# Altium schematic sheet 9-Other_Inputs.SchDoc
size A4
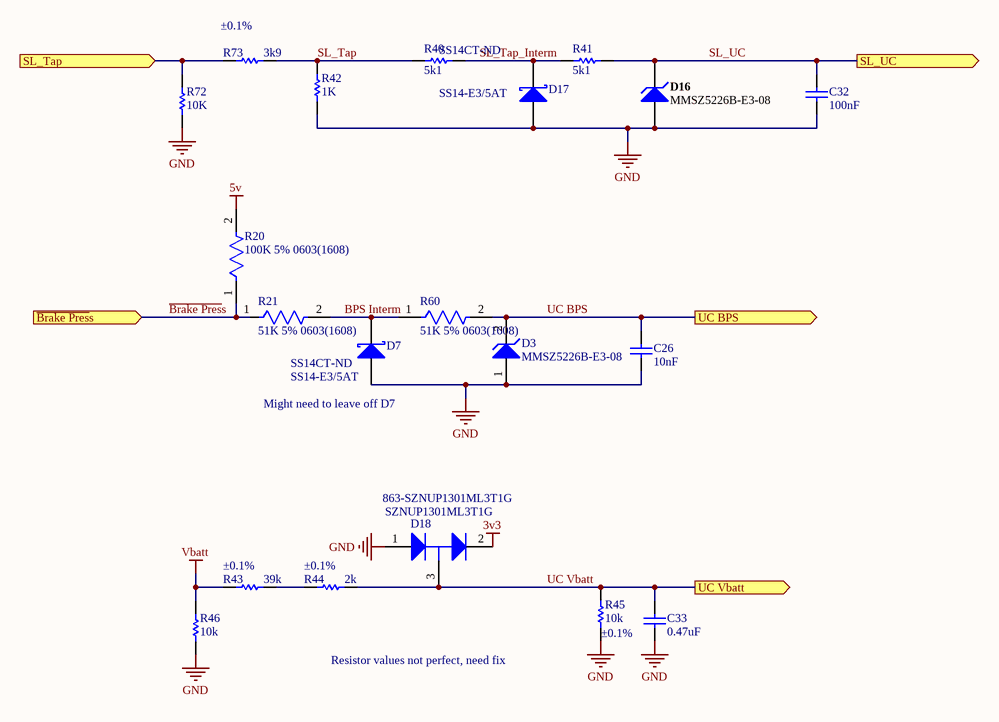
[diagram p0: 9-Other_Inputs.SchDoc]

## Parts
C26  value 10nF  [1608[0603]]  (hidden comment: Cap)
C32  value 100nF  [1608[0603]]  (hidden comment: Cap)
C33  value 0.47uF  [1608[0603]]  (hidden comment: Cap)
D3  MMSZ5226B-E3-08  [VISH-SOD-123-2_V]
D7  SS14-E3/5AT  Supplier Part Number 1: SS14CT-ND  [VISH-DO-214AC-2_V]
D16  MMSZ5226B-E3-08  [VISH-SOD-123-2_V]
D17  SS14-E3/5AT  Supplier Part Number 1: SS14CT-ND  [VISH-DO-214AC-2_V]
D18  SZNUP1301ML3T1G  Supplier Part Number 1: 863-SZNUP1301ML3T1G  [ONSC-SOT-23-3-318-08_V]
R20  100K 5% 0603(1608)  [RESC0603(1608)_N]
R21  51K 5% 0603(1608)  [RESC0603(1608)_N]
R40  value 5k1  [1608[0603]]  (hidden comment: Res1)
R41  value 5k1  [1608[0603]]  (hidden comment: Res1)
R42  value 1K  [1608[0603]]  (hidden comment: Res1)
R43  value 39k  Tolerance: ±0.1%  [1608[0603]]  (hidden comment: Res1)
R44  value 2k  Tolerance: ±0.1%  [1608[0603]]  (hidden comment: Res1)
R45  value 10k  Tolerance: ±0.1%  [1608[0603]]  (hidden comment: Res1)
R46  value 10k  [1608[0603]]  (hidden comment: Res1)
R60  51K 5% 0603(1608)  [RESC0603(1608)_N]
R72  10K  [RESC0603(1608)_N]
R73  value 3k9  Tolerance: ±0.1%  [1608[0603]]  (hidden comment: Res1)

## Ports
SL_Tap (in), SL_UC (out), UC BPS (out), UC Vbatt (out), ~{Brake Pres}s (in)

## Nets
3v3: D18.2(K)
5v: R20.2
GND: C26.1 C32.1 C33.1 D3.1(K) D7.1(A) D16.1(A) D17.1(A) D18.1(A) R42.1 R45.1 R46.1 R72.1
Vbatt: R43.1 R46.2
~{Brake Pres}s: R20.1 R21.1 ; port ~{Brake Pres}s
BPS Interm: D7.2(K) R21.2 R60.1
SL_Tap: R40.2 R42.2 R73.2
SL_Tap: R72.2 R73.1 ; port SL_Tap  [a separate net that carries the same name]
SL_Tap_Interm: D17.2(K) R40.1 R41.2
SL_UC: C32.2 D16.2(K) R41.1 ; port SL_UC
UC BPS: C26.2 D3.2(A) R60.2 ; port UC BPS
UC Vbatt: C33.2 D18.3(K/A) R44.2 R45.2 ; port UC Vbatt
NetR43_2: R43.2 R44.1

## Notes on the sheet
- (near D7) Might need to leave off D7
- Resistor values not perfect, need fix

## Library data of the parts
C26 = Cap: Capacitor; Manufacturer: Yageo; Manufacturer Part Number: CC0603KRX7R9BB104; Capacitance: 0.10µF; Tolerance: ±10%; Voltage - Rated: 50V; Temperature Coefficient: X7R; Supplier 1: Digi-Key; Supplier Part Number 1: 311-1344-1-ND; RoHS: RoHS Compliant; Category: Capacitors; Stock 1: 4016262; Pricing 1: 1=0.15, 10=0.043, 25=0.0312, 50=0.0232, 100=0.0189, 250=0.0158, 500=0.01346, 1000=0.01059 (CAD); Packaging: Cut Tape (CT); Part Status: Active; Operating Temperature: -55°C ~ 125°C; Features: -; Ratings: -; Applications: General Purpose; Failure Rate: -; Mounting Type: Surface Mount, MLCC; Package / Case: 0603 (1608 Metric); Size / Dimension: 0.063" L x 0.031" W (1.60mm x 0.80mm); Height - Seated (Max): -; Thickness (Max): 0.035" (0.90mm); Lead Spacing: -; Lead Style: -; ComponentLink1URL: http://www.yageo.com/documents/recent/UPY-GPHC_X7R_6.3V-to-50V_16.pdf; ComponentLink1Description: http://www.yageo.com/documents/recent/UPY-GPHC_X7R_6.3V-to-50V_16.pdf
C32 = Cap: Capacitor; Manufacturer: Yageo; Manufacturer Part Number: CC0603KRX7R9BB102; Capacitance: 1000pF; Tolerance: ±10%; Voltage - Rated: 50V; Temperature Coefficient: X7R; Supplier 1: Digi-Key; Supplier Part Number 1: 311-1080-1-ND; RoHS: RoHS Compliant; Category: Capacitors; Stock 1: 783486; Pricing 1: 1=0.15, 10=0.029, 25=0.0212, 50=0.0158, 100=0.0129, 250=0.01084, 500=0.00928, 1000=0.00729 (CAD); Packaging: Cut Tape (CT); Part Status: Active; Operating Temperature: -55°C ~ 125°C; Features: -; Ratings: -; Applications: General Purpose; Failure Rate: -; Mounting Type: Surface Mount, MLCC; Package / Case: 0603 (1608 Metric); Size / Dimension: 0.063" L x 0.031" W (1.60mm x 0.80mm); Height - Seated (Max): -; Thickness (Max): 0.035" (0.90mm); Lead Spacing: -; Lead Style: -; ComponentLink1URL: http://www.yageo.com/documents/recent/UPY-GPHC_X7R_6.3V-to-50V_16.pdf; ComponentLink1Description: http://www.yageo.com/documents/recent/UPY-GPHC_X7R_6.3V-to-50V_16.pdf
C33 = Cap: Capacitor; Manufacturer: Yageo; Manufacturer Part Number: CC0603KRX7R8BB474; Capacitance: 0.47µF; Tolerance: ±10%; Voltage - Rated: 25V; Temperature Coefficient: X7R; Supplier 1: Digi-Key; Supplier Part Number 1: 311-1805-1-ND; RoHS: RoHS Compliant; Category: Capacitors; Stock 1: 11076; Pricing 1: 1=0.22, 10=0.158, 25=0.1156, 50=0.0898, 100=0.0745, 250=0.06168, 500=0.05226, 1000=0.04324 (CAD); Packaging: Cut Tape (CT); Part Status: Active; Operating Temperature: -55°C ~ 125°C; Features: -; Ratings: -; Applications: General Purpose; Failure Rate: -; Mounting Type: Surface Mount, MLCC; Package / Case: 0603 (1608 Metric); Size / Dimension: 0.063" L x 0.031" W (1.60mm x 0.80mm); Height - Seated (Max): -; Thickness (Max): 0.035" (0.90mm); Lead Spacing: -; Lead Style: -; ComponentLink1URL: http://www.yageo.com/documents/recent/UPY-GPHC_X7R_6.3V-to-50V_16.pdf; ComponentLink1Description: http://www.yageo.com/documents/recent/UPY-GPHC_X7R_6.3V-to-50V_16.pdf
D3 = CMP-1060-00513-1: Zener Voltage Regulator, 500 mW, 2-Pin SOD-123, Pb-Free, Tape and Reel; PartNumber: MMSZ3V6T1G; Manufacturer: On Semiconductor; P Max (W): 0.5; Packing: Tape and Reel; ComponentLink2URL: http://www.onsemi.com/pub_link/Collateral/MMSZ2V4T1-D.PDF; ComponentLink1Description: Manufacturer URL; PackageVersion: Rev. G, 10/2009; PackageDescription: 2-Pin SOD, Body 1.6 x 2.69 mm; ComponentLink2Description: Datasheet; DatasheetVersion: Rev. 11; ComponentLink3Description: Package Specification; ComponentLink3URL: http://www.onsemi.com/pub_link/Collateral/425-04.PDF; Mounting Technology: Surface Mount; PackageReference: SOD-123-2-425-04; ComponentLink1URL: http://www.onsemi.com/; RoHS: Pb-Free
D7 D17 = CMP-0549-00004-1: Schottky Barrier Rectifier, 40 V Maximum DC Blocking Voltage, -65 to 125 degC, 2-Pin SMA Case, RoHS; Manufacturer: Vishay Semiconductor; IFSM: 40 A; IF(AV): 1 A Max.; VRRM: 40 V Max.; VRMS: 28 V Max.; PackageReference: DO-214AC-2; RoHS: TRUE; DatasheetVersion: 12/17/2012; ComponentLink1Description: Manufacturer URL; ComponentLink2URL: http://www.vishay.com/docs/88746/ss12.pdf; PartNumber: SS14-E3/5AT; PackageVersion: Dec-12; Operating Temperature: -65 to 125 degC; ComponentLink3URL: http://www.vishay.com/docs/88746/ss12.pdf; PackageDescription: 2-Pin SMD, Body 4.245 x 2.665 mm, Height 2.29 mm; ComponentLink1URL: http://www.vishay.com/; ComponentLink3Description: Package Specification; ComponentLink2Description: Datasheet; Mounting Technology: Surface Mount; VDC: 40 V Max.; Supplier 1: Digi-Key
D16 = CMP-0931-00026-1: Small Signal Zener Diode, 3.3 V +/- 5%, -55 to 155 degC, 2-Pin SOD-123, RoHS, Tape and Reel; Manufacturer: Vishay Semiconductor; Manufacturer Part Number: MMSZ5226B-7-F; Tolerance: +/- 5%; Test Current (IZT1) (mA): 20; Power Dissipation (mW): 500; Int. Construction: Single; Zener Impedance (IZT1) (Max.) (Ohm): 28; Zener Voltage (NOM.) (V): 3.3; Voltage - Zener (Nom) (Vz): 3.3V; Power - Max: 500mW; Impedance (Max) (Zzt): 28 Ohm; Current - Reverse Leakage @ Vr: 25µA @ 1V; Voltage - Forward (Vf) (Max) @ If: 900mV @ 10mA; DatasheetVersion: Rev. 1.9; ComponentLink2Description: Datasheet; PackageReference: SOD-123-2; ComponentLink1URL: http://www.vishay.com/; ComponentLink1Description: Manufacturer URL; Mounting Technology: Surface Mount; ComponentLink3Description: Package Specification; ComponentLink3URL: http://www.vishay.com/docs/85774/mmsz5225.pdf; PartNumber: MMSZ5226B-E3-08; PackageDescription: 2-Pin SMD, Body 2.7 x 1.55 mm, Height 1.35 mm; Operating Temperature: -55 to 150 degC; Packing: Tape and Reel; PackageVersion: Rev. 1.9; ComponentLink2URL: http://www.vishay.com/docs/85774/mmsz5225.pdf; RoHS: TRUE; Supplier 1: Digi-Key; Supplier Part Number 1: MMSZ5226B-FDICT-ND; Category: Discrete Semiconductor Products; Stock 1: 45935; Pricing 1: 1=0.29, 10=0.263, 100=0.1426, 500=0.08778, 1000=0.05985 (CAD); Packaging: Cut Tape (CT); Part Status: Active; Mounting Type: Surface Mount; Package / Case: SOD-123; Supplier Device Package: SOD-123; ComponentLink4URL: http://www.diodes.com/_files/datasheets/ds18010.pdf; ComponentLink4Description: http://www.diodes.com/_files/datasheets/ds18010.pdf
D18 = CMP-1063-00171-1: Low Capacitance Diode Array for ESD Protection in a Single Data Line, 3-Pin SOT-23, Pb-Free, Tape and Reel; Manufacturer: On Semiconductor; C Max (pF): 0.9; Direction: Bidirectional; V(BR) Min (V): 70; Number of Lines: 1; Mounting Technology: Surface Mount; PackageReference: SOT-23-3-318-08; DatasheetVersion: Rev. 6; PackageVersion: Rev. AP, 11/2009; RoHS: Pb-Free; ComponentLink1Description: Manufacturer URL; ComponentLink1URL: http://www.onsemi.com/; PackageDescription: 3-Pin Small Outline Transistor, Body 2.92 x 1.3 mm, Pitch 0.95 mm; PartNumber: SZNUP1301ML3T1G; Packing: Tape and Reel; ComponentLink3URL: http://www.onsemi.cn/pub_link/Collateral/318-08.PDF; ComponentLink3Description: Package Specification; VRWM Max (V): 70; ComponentLink2Description: Datasheet; ComponentLink2URL: http://www.onsemi.cn/pub_link/Collateral/NUP1301ML3T1-D.PDF; Supplier 1: Mouser
R20 R21 R60 = CMP-26527-002098-1: 10kΩ ±5% 0.1W 0603 Thick Film Chip Resistor AEC-Q200 compliant; Power Rating: 100mW; Temperature Coefficient: 100ppm/°C; Resistance: 10kR; Radiation Hardening: No; Military Standard: Not; Mount: Surface Mount; Resistor Type: Thick Film; Size Code: 0603; Case/Package: 0603; Min Operating Temperature: -55°C; Construction: Rectangular; Series: RMCF; Width: 0.031inch; Length: 1.55mm; Case Code (Metric): 1608; Depth: 0.8mm; Height: 0.022inch; Packaging: Tape and Reel; Lead Free: Lead Free; Tolerance: 5%; Case Code (Imperial): 0603; Max Operating Temperature: 155°C; Contact Plating: Tin; Max Power Dissipation: 100mW; Features: Automotive AEC-Q200; Number of Terminations: 2
R40 R41 = Res1: Resistor; Manufacturer: Panasonic Electronic Components; Manufacturer Part Number: ERJ-PA3F1001V; Resistance (Ohms): 1k; Tolerance: ±1%; Power (Watts): 0.25W, 1/4W; Temperature Coefficient: ±100ppm/°C; Supplier 1: Digi-Key; Supplier Part Number 1: P1.0KBYCT-ND; RoHS: RoHS Compliant; Category: Resistors; Stock 1: 56110; Pricing 1: 1=0.22, 10=0.198, 25=0.138, 50=0.1072, 100=0.0765, 250=0.05972, 500=0.04746, 1000=0.03368 (CAD); Packaging: Cut Tape (CT); Part Status: Active; Composition: Thick Film; Features: Automotive AEC-Q200, Pulse Withstanding; Operating Temperature: -55°C ~ 155°C; Package / Case: 0603 (1608 Metric); Supplier Device Package: 0603; Size / Dimension: 0.063" L x 0.031" W (1.60mm x 0.80mm); Height - Seated (Max): 0.022" (0.55mm); Number of Terminations: 2; Failure Rate: -; ComponentLink1URL: https://industrial.panasonic.com/cdbs/www-data/pdf/RDA0000/AOA0000C243.pdf; ComponentLink1Description: https://industrial.panasonic.com/cdbs/www-data/pdf/RDA0000/AOA0000C243.pdf
R42 = Res1: Resistor; Manufacturer: Panasonic Electronic Components; Manufacturer Part Number: ERJ-PA3F1001V; Tolerance: ±1%; Power (Watts): 0.25W, 1/4W; Temperature Coefficient: ±100ppm/°C; Supplier 1: Digi-Key; Supplier Part Number 1: P1.0KBYCT-ND; RoHS: RoHS Compliant; Category: Resistors; Stock 1: 56110; Pricing 1: 1=0.22, 10=0.198, 25=0.138, 50=0.1072, 100=0.0765, 250=0.05972, 500=0.04746, 1000=0.03368 (CAD); Packaging: Cut Tape (CT); Part Status: Active; Resistance (Ohms): 1k; Composition: Thick Film; Features: Automotive AEC-Q200, Pulse Withstanding; Operating Temperature: -55°C ~ 155°C; Package / Case: 0603 (1608 Metric); Supplier Device Package: 0603; Size / Dimension: 0.063" L x 0.031" W (1.60mm x 0.80mm); Height - Seated (Max): 0.022" (0.55mm); Number of Terminations: 2; Failure Rate: -; ComponentLink1URL: https://industrial.panasonic.com/cdbs/www-data/pdf/RDA0000/AOA0000C243.pdf; ComponentLink1Description: https://industrial.panasonic.com/cdbs/www-data/pdf/RDA0000/AOA0000C243.pdf
R43 = Res1: Resistor; Manufacturer: Yageo; Manufacturer Part Number: RT0603BRD0739KL; Power (Watts): 0.1W, 1/10W; Temperature Coefficient: ±25ppm/°C; Supplier 1: Digi-Key; Supplier Part Number 1: YAG1649CT-ND; RoHS: RoHS Compliant; Category: Resistors; Stock 1: 2740; Pricing 1: 1=0.55, 10=0.464, 25=0.3376, 50=0.2446, 100=0.1814, 250=0.1392, 500=0.10966, 1000=0.07592 (CAD); Packaging: Cut Tape (CT); Part Status: Active; Resistance (Ohms): 39k; Composition: Thin Film; Features: Moisture Resistant; Operating Temperature: -55°C ~ 155°C; Package / Case: 0603 (1608 Metric); Supplier Device Package: 0603; Size / Dimension: 0.063" L x 0.031" W (1.60mm x 0.80mm); Height - Seated (Max): 0.022" (0.55mm); Number of Terminations: 2; Failure Rate: -; ComponentLink1URL: http://www.yageo.com/documents/recent/PYu-RT_1-to-0.05_RoHS_L_6.pdf; ComponentLink1Description: http://www.yageo.com/documents/recent/PYu-RT_1-to-0.05_RoHS_L_6.pdf
R44 = Res1: Resistor; Manufacturer: Yageo; Manufacturer Part Number: AT0603BRD072KL; Power (Watts): 0.1W, 1/10W; Temperature Coefficient: ±25ppm/°C; Supplier 1: Digi-Key; Supplier Part Number 1: YAG2112CT-ND; RoHS: RoHS Compliant; Category: Resistors; Stock 1: 1218; Pricing 1: 1=0.59, 10=0.431, 25=0.3188, 50=0.235, 100=0.1725, 250=0.14248, 500=0.11746, 1000=0.08498 (CAD); Packaging: Cut Tape (CT); Part Status: Active; Resistance (Ohms): 2k; Composition: Thin Film; Features: Anti-Sulfur, Automotive AEC-Q200, Moisture Resistant; Operating Temperature: -55°C ~ 155°C; Package / Case: 0603 (1608 Metric); Supplier Device Package: 0603; Size / Dimension: 0.063" L x 0.032" W (1.60mm x 0.80mm); Height - Seated (Max): 0.022" (0.55mm); Number of Terminations: 2; Failure Rate: -; ComponentLink1URL: http://www.yageo.com/documents/recent/PYu-AT_51_RoHS_L-3.pdf; ComponentLink1Description: http://www.yageo.com/documents/recent/PYu-AT_51_RoHS_L-3.pdf
R45 = Res1: Resistor; Manufacturer: Yageo; Manufacturer Part Number: RT0603BRD0710KL; Power (Watts): 0.1W, 1/10W; Temperature Coefficient: ±25ppm/°C; Supplier 1: Digi-Key; Supplier Part Number 1: YAG1236CT-ND; RoHS: RoHS Compliant; Category: Resistors; Stock 1: 2958; Pricing 1: 1=0.5, 10=0.42, 25=0.3048, 50=0.2212, 100=0.164, 250=0.12592, 500=0.0992, 1000=0.06867 (CAD); Packaging: Cut Tape (CT); Part Status: Active; Resistance (Ohms): 10k; Composition: Thin Film; Features: Moisture Resistant; Operating Temperature: -55°C ~ 155°C; Package / Case: 0603 (1608 Metric); Supplier Device Package: 0603; Size / Dimension: 0.063" L x 0.031" W (1.60mm x 0.80mm); Height - Seated (Max): 0.022" (0.55mm); Number of Terminations: 2; Failure Rate: -; ComponentLink1URL: http://www.yageo.com/documents/recent/PYu-RT_1-to-0.05_RoHS_L_6.pdf; ComponentLink1Description: http://www.yageo.com/documents/recent/PYu-RT_1-to-0.05_RoHS_L_6.pdf
R46 = Res1: Resistor; Manufacturer: Yageo; Manufacturer Part Number: RC0603JR-0710KL; Tolerance: ±5%; Power (Watts): 0.1W, 1/10W; Temperature Coefficient: ±100ppm/°C; Supplier 1: Digi-Key; Supplier Part Number 1: 311-10KGRCT-ND; RoHS: RoHS Compliant; Category: Resistors; Stock 1: 2936292; Pricing 1: 1=0.16, 10=0.016, 25=0.0112, 50=0.0084, 100=0.0062, 250=0.0048, 500=0.00382, 1000=0.00281 (CAD); Packaging: Cut Tape (CT); Part Status: Active; Resistance (Ohms): 10k; Composition: Thick Film; Features: Moisture Resistant; Operating Temperature: -55°C ~ 155°C; Package / Case: 0603 (1608 Metric); Supplier Device Package: 0603; Size / Dimension: 0.063" L x 0.031" W (1.60mm x 0.80mm); Height - Seated (Max): 0.022" (0.55mm); Number of Terminations: 2; Failure Rate: -; ComponentLink1URL: http://www.yageo.com/NewPortal/yageodocoutput?fileName=/pdf/R-Chip/PYu-RC_Group_51_RoHS_L_4.pdf; ComponentLink1Description: http://www.yageo.com/NewPortal/yageodocoutput?fileName=/pdf/R-Chip/PYu-RC_Group_51_RoHS_L_4.pdf
R72 = CMP-1012-00098-1: 10K 0.1W 5% 0603 (1608 Metric)  SMD; Case-EIA: 0603; Value: 10000.00 Ohm; Case-Metric: 1608; Technology: SMT; Tolerance: 5 %; Power: 0.1 W
R73 = Res1: Resistor; Manufacturer: Yageo; Manufacturer Part Number: RT0603BRD073K9L; Resistance (Ohms): 3.9k; Power (Watts): 0.1W, 1/10W; Temperature Coefficient: ±25ppm/°C; Supplier 1: Digi-Key; Supplier Part Number 1: YAG1656CT-ND; RoHS: RoHS Compliant; Category: Resistors; Stock 1: 10688; Pricing 1: 1=0.55, 10=0.464, 25=0.3376, 50=0.2446, 100=0.1814, 250=0.1392, 500=0.10966, 1000=0.07592 (CAD); Packaging: Cut Tape (CT); Part Status: Active; Composition: Thin Film; Features: Moisture Resistant; Operating Temperature: -55°C ~ 155°C; Package / Case: 0603 (1608 Metric); Supplier Device Package: 0603; Size / Dimension: 0.063" L x 0.031" W (1.60mm x 0.80mm); Height - Seated (Max): 0.022" (0.55mm); Number of Terminations: 2; Failure Rate: -; ComponentLink1URL: http://www.yageo.com/documents/recent/PYu-RT_1-to-0.05_RoHS_L_6.pdf; ComponentLink1Description: http://www.yageo.com/documents/recent/PYu-RT_1-to-0.05_RoHS_L_6.pdf